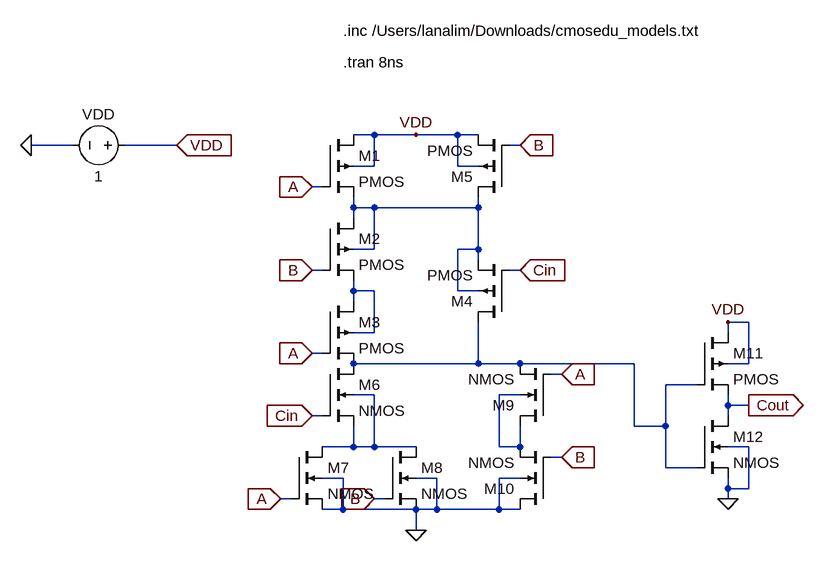
[diagram p0: schematic partial_adder.asc]
partial_adder.asc, the LTspice schematic file:
Version 4
SHEET 1 1556 736
WIRE 560 32 528 32
WIRE 624 32 560 32
WIRE 688 32 624 32
WIRE 720 32 688 32
WIRE 96 48 32 48
WIRE 256 48 176 48
WIRE 784 48 768 48
WIRE 560 80 560 32
WIRE 560 80 528 80
WIRE 688 80 688 32
WIRE 720 80 688 80
WIRE 480 112 464 112
WIRE 528 144 528 128
WIRE 560 144 528 144
WIRE 720 144 720 128
WIRE 720 144 560 144
WIRE 528 160 528 144
WIRE 560 208 560 144
WIRE 560 208 528 208
WIRE 720 208 720 144
WIRE 720 208 688 208
WIRE 720 224 720 208
WIRE 480 240 464 240
WIRE 784 240 768 240
WIRE 528 272 528 256
WIRE 560 272 528 272
WIRE 688 272 688 208
WIRE 720 272 688 272
WIRE 528 288 528 272
WIRE 1136 320 1104 320
WIRE 560 336 560 272
WIRE 560 336 528 336
WIRE 1104 336 1104 320
WIRE 480 368 464 368
WIRE 720 384 720 320
WIRE 720 384 528 384
WIRE 784 384 720 384
WIRE 960 384 784 384
WIRE 1136 384 1136 320
WIRE 1136 384 1104 384
WIRE 848 400 832 400
WIRE 1056 416 1008 416
WIRE 560 432 528 432
WIRE 784 432 752 432
WIRE 1104 448 1104 432
WIRE 1136 448 1104 448
WIRE 480 464 464 464
WIRE 1104 464 1104 448
WIRE 960 480 960 384
WIRE 1008 480 1008 416
WIRE 1008 480 960 480
WIRE 528 512 528 480
WIRE 528 512 480 512
WIRE 560 512 560 432
WIRE 560 512 528 512
WIRE 624 512 560 512
WIRE 752 512 752 432
WIRE 784 512 784 480
WIRE 784 512 752 512
WIRE 1136 512 1104 512
WIRE 848 528 832 528
WIRE 1008 544 1008 480
WIRE 1056 544 1008 544
WIRE 512 560 480 560
WIRE 656 560 624 560
WIRE 784 560 752 560
WIRE 1104 576 1104 560
WIRE 1136 576 1136 512
WIRE 1136 576 1104 576
WIRE 432 592 416 592
WIRE 576 592 560 592
WIRE 1104 592 1104 576
WIRE 512 608 512 560
WIRE 512 608 480 608
WIRE 624 608 512 608
WIRE 656 608 656 560
WIRE 656 608 624 608
WIRE 752 608 752 560
WIRE 752 608 656 608
WIRE 784 608 752 608
WIRE 624 640 624 608
FLAG 464 112 A
IOPIN 464 112 In
FLAG 464 240 B
IOPIN 464 240 In
FLAG 464 368 A
IOPIN 464 368 In
FLAG 784 48 B
IOPIN 784 48 In
FLAG 784 240 Cin
IOPIN 784 240 In
FLAG 624 32 VDD
FLAG 464 464 Cin
IOPIN 464 464 In
FLAG 416 592 A
IOPIN 416 592 In
FLAG 560 592 B
IOPIN 560 592 In
FLAG 848 528 B
IOPIN 848 528 In
FLAG 848 400 A
IOPIN 848 400 In
FLAG 1104 320 VDD
FLAG 1104 592 0
FLAG 1136 448 Cout
IOPIN 1136 448 Out
FLAG 624 640 0
FLAG 32 48 0
FLAG 256 48 VDD
IOPIN 256 48 In
SYMBOL pmos4 480 32 R0
SYMATTR InstName M1
SYMATTR Value2 l=1e-7 w=9e-7
SYMBOL pmos4 480 160 R0
SYMATTR InstName M2
SYMATTR Value2 l=1e-7 w=9e-7
SYMBOL pmos4 480 288 R0
SYMATTR InstName M3
SYMATTR Value2 l=1e-7 w=9e-7
SYMBOL pmos4 768 320 R180
SYMATTR InstName M4
SYMATTR Value2 l=1e-7 w=6e-7
SYMBOL pmos4 768 128 R180
SYMATTR InstName M5
SYMATTR Value2 l=1e-7 w=6e-7
SYMBOL nmos4 480 384 R0
SYMATTR InstName M6
SYMATTR Value2 l=1e-7 w=4e-7
SYMBOL nmos4 432 512 R0
SYMATTR InstName M7
SYMATTR Value2 l=1e-7 w=4e-7
SYMBOL nmos4 576 512 R0
SYMATTR InstName M8
SYMATTR Value2 l=1e-7 w=4e-7
SYMBOL nmos4 832 480 R180
SYMATTR InstName M9
SYMATTR Value2 l=1e-7 w=4e-7
SYMBOL nmos4 832 608 R180
SYMATTR InstName M10
SYMATTR Value2 l=1e-7 w=4e-7
SYMBOL pmos4 1056 336 R0
SYMATTR InstName M11
SYMATTR Value2 l=1e-7 w=3e-7
SYMBOL nmos4 1056 464 R0
SYMATTR InstName M12
SYMATTR Value2 l=1e-7 w=2e-7
SYMBOL voltage 192 48 R90
WINDOW 0 -32 56 VBottom 2
WINDOW 3 32 56 VTop 2
SYMATTR InstName VDD
SYMATTR Value 1
TEXT 512 -128 Left 2 !.inc /Users/lanalim/Downloads/cmosedu_models.txt
TEXT 512 -80 Left 2 !.tran 8ns

The netlist it stands for:
* partial_adder.asc
M1 VDD A N001 VDD PMOS l=1e-7 w=9e-7
M2 N001 B N002 N001 PMOS l=1e-7 w=9e-7
M3 N002 A N003 N002 PMOS l=1e-7 w=9e-7
M4 N003 Cin N001 N001 PMOS l=1e-7 w=6e-7
M5 N001 B VDD VDD PMOS l=1e-7 w=6e-7
M6 N003 Cin N004 N004 NMOS l=1e-7 w=4e-7
M7 N004 A 0 0 NMOS l=1e-7 w=4e-7
M8 N004 B 0 0 NMOS l=1e-7 w=4e-7
M9 N005 A N003 N005 NMOS l=1e-7 w=4e-7
M10 0 B N005 0 NMOS l=1e-7 w=4e-7
M11 VDD N003 Cout VDD PMOS l=1e-7 w=3e-7
M12 Cout N003 0 0 NMOS l=1e-7 w=2e-7
VDD VDD 0 1
.model NMOS NMOS
.model PMOS PMOS
.lib standard.mos
.inc /Users/lanalim/Downloads/cmosedu_models.txt
.tran 8ns
.backanno
.end